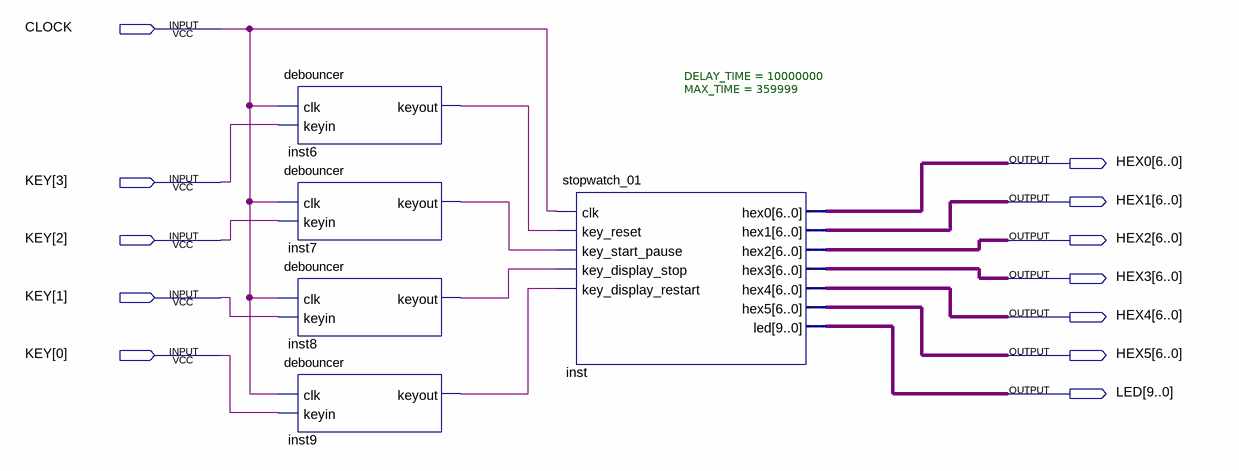
[diagram p0: schematic sheet]
// Quartus schematic my_stopwatch.bdf as structural Verilog: 5 symbols, 12 pins
module my_stopwatch (
  input  CLOCK,
  input  [3:0] KEY,
  output [6:0] HEX0,
  output [6:0] HEX1,
  output [6:0] HEX2,
  output [6:0] HEX3,
  output [6:0] HEX4,
  output [6:0] HEX5,
  output [9:0] LED
);

  wire inst6_keyout, inst7_keyout, inst8_keyout, inst9_keyout;

  debouncer inst6 (.clk(CLOCK), .keyin(KEY[3]), .keyout(inst6_keyout));
  debouncer inst7 (.clk(CLOCK), .keyin(KEY[2]), .keyout(inst7_keyout));
  debouncer inst8 (.clk(CLOCK), .keyin(KEY[1]), .keyout(inst8_keyout));
  debouncer inst9 (.clk(CLOCK), .keyin(KEY[0]), .keyout(inst9_keyout));
  stopwatch_01 #(.DELAY_TIME(10000000), .MAX_TIME(359999)) inst (
    .clk(CLOCK), .key_reset(inst6_keyout), .key_start_pause(inst7_keyout), .key_display_stop(inst8_keyout),
    .key_display_restart(inst9_keyout), .hex0(HEX0), .hex1(HEX1), .hex2(HEX2), .hex3(HEX3), .hex4(HEX4),
    .hex5(HEX5), .led(LED));
endmodule
